# Altium schematic sheet 01b3_HID_Processor_W_BT.SchDoc
size 353 x 223 mm; SheetNumber: 2
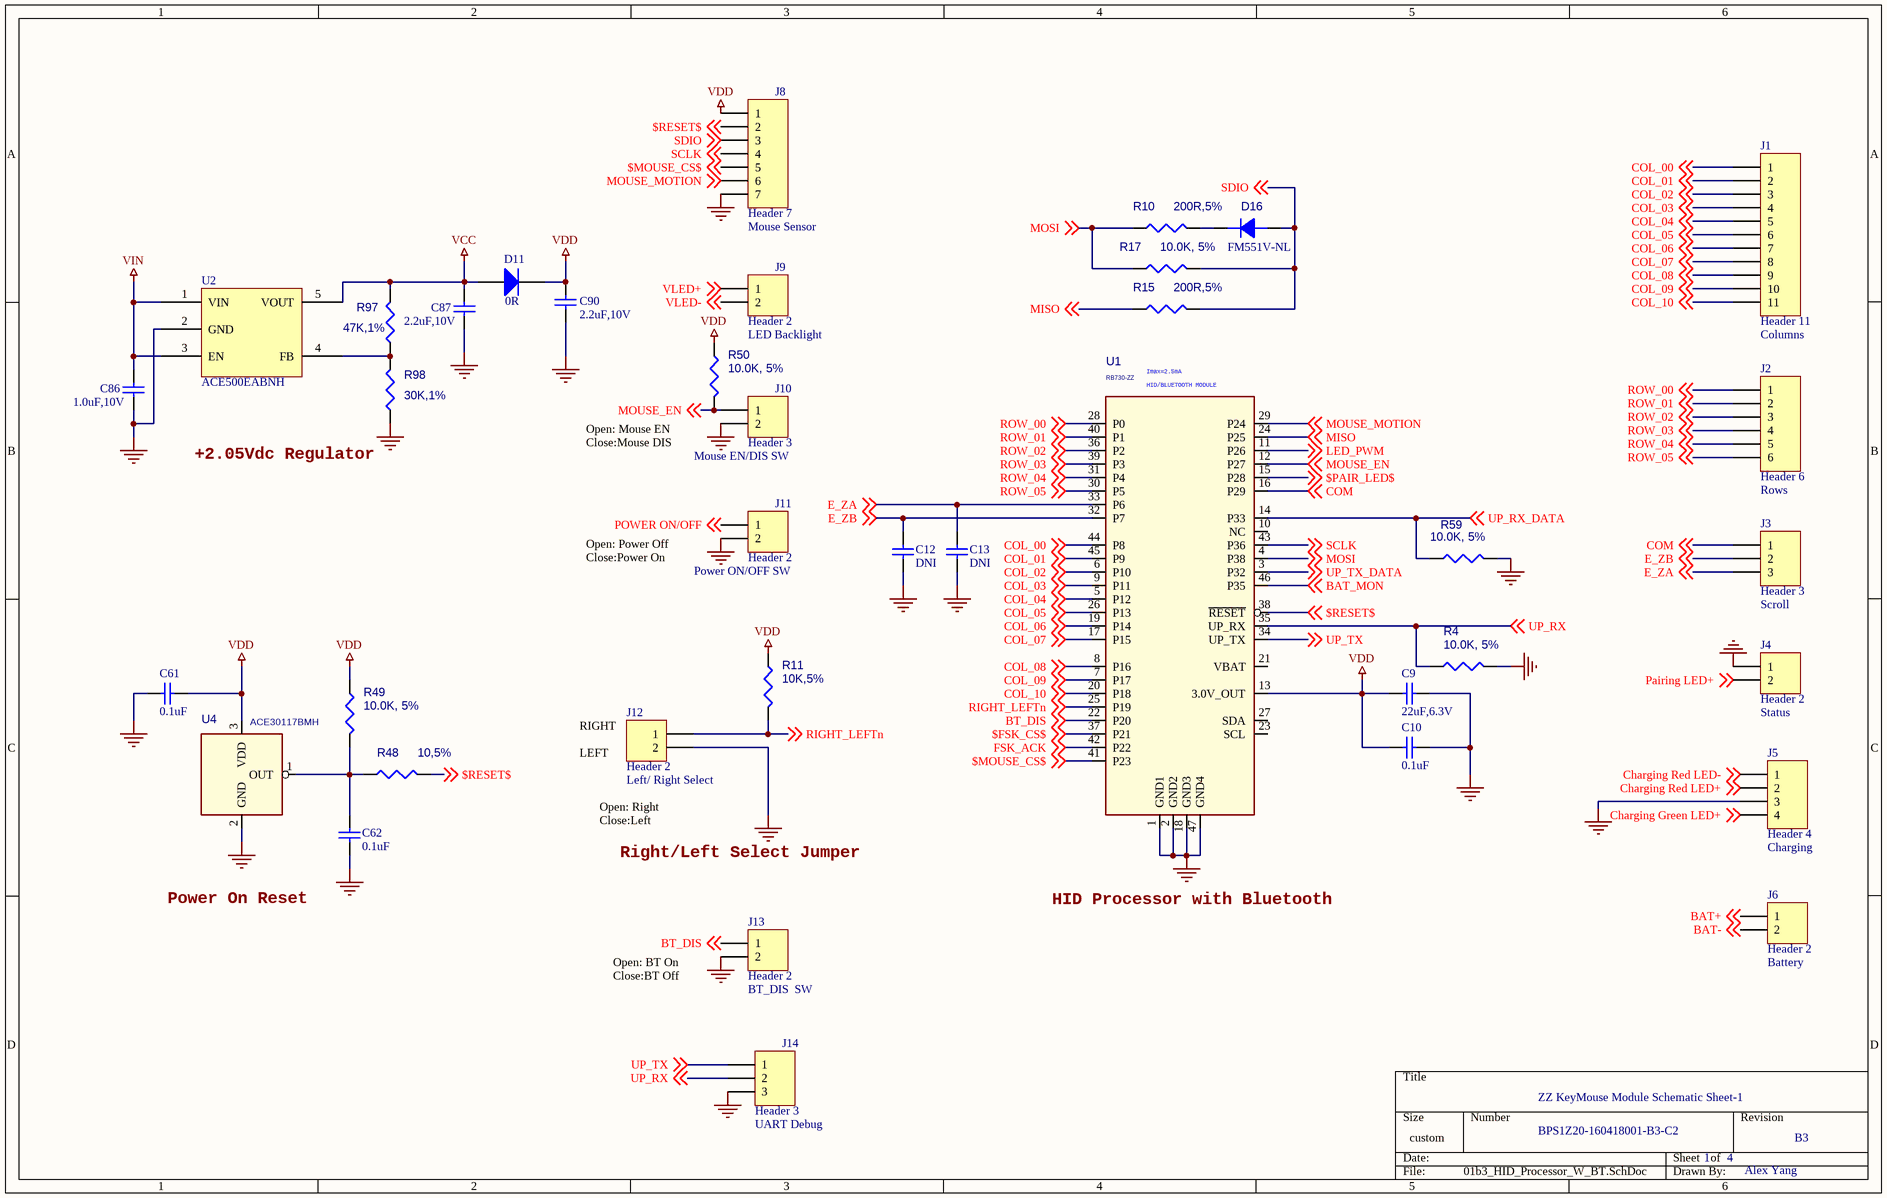
[diagram p0: 01b3_HID_Processor_W_BT.SchDoc]

## Parts
C9  22uF,6.3V  [MIN0805]
C10  0.1uF  [0603]
C12  DNI  [0603-2]
C13  DNI  [0603-2]
C61  0.1uF  [0603]
C62  0.1uF  [0603]
C86  1.0uF,10V  [0603]
C87  2.2uF,10V  [0603]
C90  2.2uF,10V  [0603]
D11  0R  [SM08-DIODE]
D16  DIODE  [FM551-NL]  (value not drawn)
J1  Header 11  [HDR1X11H]
J2  Header 6  [HDR1X6H]
J3  Header 3  [HDR1X3H]
J4  Header 2  [HDR1X2H]
J5  Header 4  [HDR1X4H]
J6  Header 2  [HDR1X2H]
J8  Header 7  [HDR1X7h]
J9  Header 2  [HDR1X2h]
J10  Header 3  [HDR1X2h]
J11  Header 2  [HDR1X2h]
J12  Header 2  [HDR1X2]
J13  Header 2  [HDR1X2H]
J14  Header 3  [HDR1X3]
R4  10.0K, 5%  [0402]
R10  200R,5%  [0402]
R11  10K,5%  [0402]
R15  200R,5%  [0402]
R17  10.0K, 5%  [0402]
R48  10,5%  [0402]
R49  10.0K, 5%  [0402]
R50  10.0K, 5%  [0402]
R59  10.0K, 5%  [0402]
R97  47K,1%  [0402]
R98  30K,1%  [0402]
U1  RB730-ZZ  [RB730_SMD_MOD]
U2  ACE500EABNH  [SOT23-5]
U4  ACE30117BMH  [SOT23]

## Nets
GND: C9.1 C10.1 C12.2 C13.2 C61.2 C62.2 C86.1 C87.1 C90.1 J4.1 J5.3 J8.7 J10.2 J11.2 J12.2 J13.2 J14.3 R4.2 R59.2 R98.2 U1.1(GND1) U1.2(GND2) U1.18(GND3) U1.47(GND4) U2.2(GND) U4.2(GND)
VCC: C87.2 D11.1(A) R97.1 U2.5(VOUT)
VDD: C9.2 C10.2 C61.1 C90.2 D11.2(K) J8.1 R11.1 R49.1 R50.1 U1.13(3.0V_OUT) U4.3(VDD)
VIN: C86.2 U2.1(VIN) U2.3(EN)
$FSK_CS$: U1.37(P21) ; off-sheet $FSK_CS$
$MOUSE_CS$: J8.5 U1.41(P23) ; off-sheet $MOUSE_CS$
$PAIR_LED$: U1.15(P28) ; off-sheet $PAIR_LED$
$RESET$: J8.2 R48.2 U1.38(~{RESET}) ; off-sheet $RESET$
BAT+: J6.1 ; off-sheet BAT+
BAT-: J6.2 ; off-sheet BAT-
BAT_MON: U1.46(P35) ; off-sheet BAT_MON
BT_DIS: J13.1 U1.22(P20) ; off-sheet BT_DIS
Charging Green LED+: J5.4 ; off-sheet Charging Green LED+
Charging Red LED+: J5.2 ; off-sheet Charging Red LED+
Charging Red LED-: J5.1 ; off-sheet Charging Red LED-
COL_00: J1.1 U1.44(P8) ; off-sheet COL_00
COL_01: J1.2 U1.45(P9) ; off-sheet COL_01
COL_02: J1.3 U1.6(P10) ; off-sheet COL_02
COL_03: J1.4 U1.9(P11) ; off-sheet COL_03
COL_04: J1.5 U1.5(P12) ; off-sheet COL_04
COL_05: J1.6 U1.26(P13) ; off-sheet COL_05
COL_06: J1.7 U1.19(P14) ; off-sheet COL_06
COL_07: J1.8 U1.17(P15) ; off-sheet COL_07
COL_08: J1.9 U1.8(P16) ; off-sheet COL_08
COL_09: J1.10 U1.7(P17) ; off-sheet COL_09
COL_10: J1.11 U1.20(P18) ; off-sheet COL_10
COM: J3.1 U1.16(P29) ; off-sheet COM
E_ZA: C13.1 J3.3 U1.33(P6) ; off-sheet E_ZA
E_ZB: C12.1 J3.2 U1.32(P7) ; off-sheet E_ZB
FSK_ACK: U1.42(P22) ; off-sheet FSK_ACK
LED_PWM: U1.11(P26) ; off-sheet LED_PWM
MISO: R15.1 U1.24(P25) ; off-sheet MISO
MOSI: R10.1 R17.1 U1.4(P38) ; off-sheet MOSI
MOUSE_EN: J10.1 R50.2 U1.12(P27) ; off-sheet MOUSE_EN
MOUSE_MOTION: J8.6 U1.29(P24) ; off-sheet MOUSE_MOTION
Pairing LED+: J4.2 ; off-sheet Pairing LED+
POWER ON/OFF: J11.1 ; off-sheet POWER ON/OFF
RIGHT_LEFTn: J12.1 R11.2 U1.25(P19) ; off-sheet RIGHT_LEFTn
ROW_00: J2.1 U1.28(P0) ; off-sheet ROW_00
ROW_01: J2.2 U1.40(P1) ; off-sheet ROW_01
ROW_02: J2.3 U1.36(P2) ; off-sheet ROW_02
ROW_03: J2.4 U1.39(P3) ; off-sheet ROW_03
ROW_04: J2.5 U1.31(P4) ; off-sheet ROW_04
ROW_05: J2.6 U1.30(P5) ; off-sheet ROW_05
SCLK: J8.4 U1.43(P36) ; off-sheet SCLK
SDIO: D16.1(A) J8.3 R15.2 R17.2 ; off-sheet SDIO
UP_RX: J14.2 R4.1 U1.35(UP_RX) ; off-sheet UP_RX
UP_RX_DATA: R59.1 U1.14(P33) ; off-sheet UP_RX_DATA
UP_TX: J14.1 U1.34(UP_TX) ; off-sheet UP_TX
UP_TX_DATA: U1.3(P32) ; off-sheet UP_TX_DATA
VLED+: J9.1 ; off-sheet VLED+
VLED-: J9.2 ; off-sheet VLED-
NetC62_1: C62.1 R48.1 R49.2 U4.1(OUT)
NetD16_2: D16.2(K) R10.2
NetR97_2: R97.2 R98.1 U2.4(FB)

Not connected (* = marked no-connect by the designer): U1 10(NC) 21(VBAT) 23(SCL) 27(SDA)

## Notes on the sheet
- (near J8) Mouse Sensor
- LED Backlight
- (near J1) Columns
- +2.05Vdc Regulator
- Open: Mouse EN
- Close:Mouse DIS
- (near J10) Mouse EN/DIS SW
- Open: Power Off
- (near J2) Rows
- Close:Power On
- (near J11) Power ON/OFF SW
- (near J3) Scroll
- RIGHT
- (near J4) Status
- LEFT
- Open: Right
- (near J12) Left/ Right Select
- Close:Left
- Right/Left Select Jumper
- (near J5) Charging
- Power On Reset
- HID Processor with Bluetooth
- Open: BT On
- Close:BT Off
- (near J13) BT_DIS  SW
- (near J6) Battery
- (near J14) UART Debug
- ZZ KeyMouse Module Schematic Sheet-1
- BPS1Z20-160418001-B3-C2
- B3
- 1
- 4
- Alex Yang
- (in symbol DIODE) FM551V-NL
- (in symbol HID/BLUETOOTH MODULE_0) Imax=2.5mA; HID/BLUETOOTH MODULE

## Library data of the parts
C9 C10 C12 C13 C61 C62 C86 C87 C90 = Cap: Capacitor
D11 = Diode: Default Diode; Published: 8-Jun-2000; LatestRevisionDate: 17-Jul-2002; LatestRevisionNote: Re-released for DXP Platform.; PackageVersion: Sep-1996; PackageReference: SMC; Publisher: Altium Limited; Code_JEDEC: DO-214-AB
J1 = Header 11H: Header, 11-Pin, Right Angle; LatestRevisionDate: 17-Jul-2002; LatestRevisionNote: Re-released for DXP Platform.; Publisher: Altium Limited
J2 = Header 6H: Header, 6-Pin, Right Angle; LatestRevisionDate: 17-Jul-2002; LatestRevisionNote: Re-released for DXP Platform.; Publisher: Altium Limited
J3 J14 = Header 3: Header, 3-Pin; LatestRevisionDate: 17-Jul-2002; LatestRevisionNote: Re-released for DXP Platform.; Publisher: Altium Limited
J4 J6 J9-J13 = Header 2: Header, 2-Pin; LatestRevisionDate: 17-Jul-2002; LatestRevisionNote: Re-released for DXP Platform.; Publisher: Altium Limited
J5 = Header 4: Header, 4-Pin; LatestRevisionDate: 17-Jul-2002; LatestRevisionNote: Re-released for DXP Platform.; Publisher: Altium Limited
J8 = Header 7: Header, 7-Pin; LatestRevisionDate: 17-Jul-2002; LatestRevisionNote: Re-released for DXP Platform.; Publisher: Altium Limited
R4 R10 R11 R15 R17 R48-R50 R59 R97 R98 = R
U1 = HID/BLUETOOTH MODULE_0
U2 = ACE500EABNH: Value: 100pF; Published: 8-Jun-2000; LatestRevisionDate: 17-Jul-2002; LatestRevisionNote: Re-released for DXP Platform.; PackageReference: RAD-0.3; Publisher: Altium Limited
U4 = STM1061N19WX6F: pin to pad: 1>2 2>3 3>1